# Altium project M2_Mosaic-G5_Smart.PrjPcb
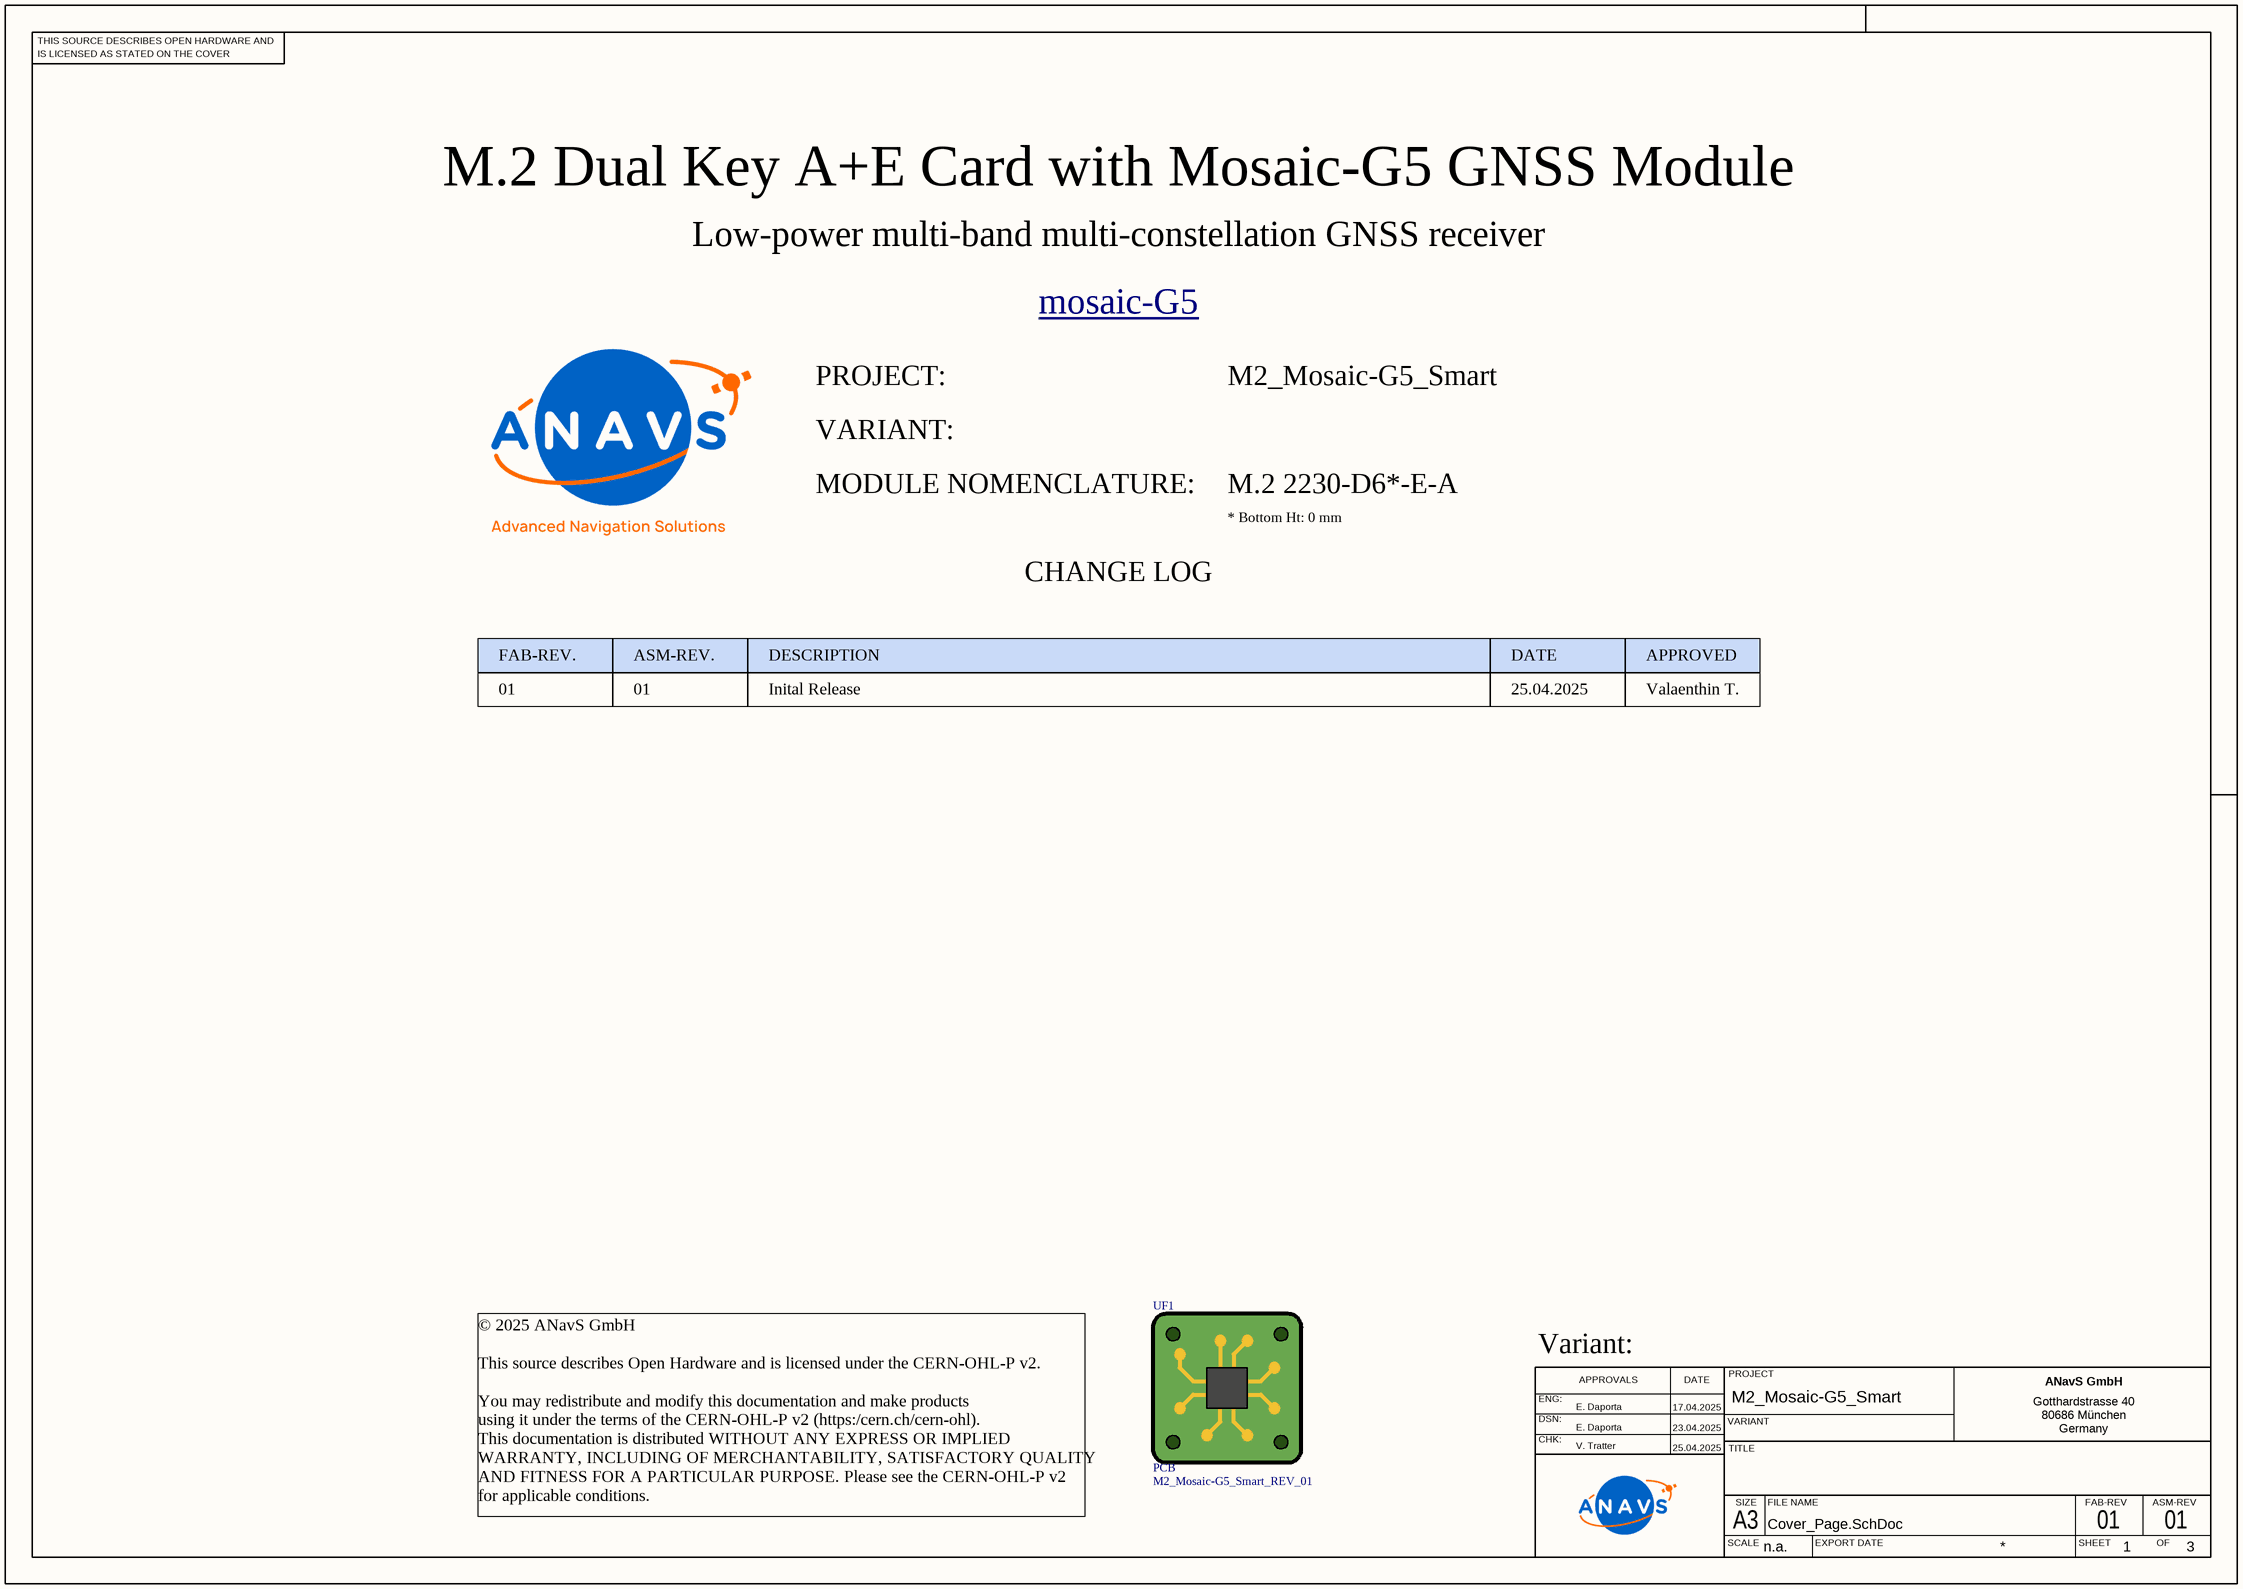
[diagram p0: Cover_Page.SchDoc]
ASM_REVISION: 01; Assembly_Drawing_Title: M2 Mosaic-G5 SMART PCBA Assembly; CheckedBy: V. Tratter; CHK_APP_DATE: 25.04.2025; COPYRIGHT: © ANavS 2025; DrawnBy: E. Daporta; DSN_APP_DATE: 23.04.2025; ENG_APP_DATE: 17.04.2025; Engineer: E. Daporta; FAB_REVISION: 01; Fabrication_Drawing_Title: M2 Mosaic-G5 SMART PCB Fabrication; LICENSE_NOTICE: Licensed under CERN-OHL-P v2; MODULE_NOMENCLATURE: M.2 2230-D6*-E-A; PROJECT: M2_Mosaic-G5_Smart; SCH_SCALE: n.a.
3 sheets, 17 parts. Net scope: flat (ports and power ports of the same name join across sheets).
Board file: M2_Mosaic-G5_Smart.PcbDoc
Sheets:
  Cover_Page.SchDoc
  M.2_Key_A+E_Card.SchDoc
  Mosaic-G5.SchDoc

## Sheet Cover_Page.SchDoc
size 420 x 297 mm; CompanyName: ANavS GmbH; Organization: ANavS; Address1: ANavS GmbH; Address2: Gotthardstrasse 40; Address3: 80686 München; Address4: Germany; SheetNumber: 1; SheetTotal: 3

### Parts
UF1  PCB  value M2_Mosaic-G5_Smart_REV_01  (mechanical)

### Notes on the sheet
- M.2 Dual Key A+E Card with Mosaic-G5 GNSS Module
- Low-power multi-band multi-constellation GNSS receiver
- mosaic-G5 <https://www.septentrio.com/en/septentrio-extends-its-mosaic-family>
- PROJECT:
- VARIANT:
- MODULE NOMENCLATURE:
- * Bottom Ht: 0 mm
- CHANGE LOG
- FAB-REV.
- ASM-REV.
- DESCRIPTION
- DATE
- APPROVED
- 01
- Inital Release
- 25.04.2025
- Valaenthin T.
- Variant:
- © 2025 ANavS GmbH
  This source describes Open Hardware and is licensed under the CERN-OHL-P v2.
  You may redistribute and modify this documentation and make products
  using it under the terms of the CERN-OHL-P v2 (https:/cern.ch/cern-ohl).
  This documentation is distributed WITHOUT ANY EXPRESS OR IMPLIED
  WARRANTY, INCLUDING OF MERCHANTABILITY, SATISFACTORY QUALITY
  AND FITNESS FOR A PARTICULAR PURPOSE. Please see the CERN-OHL-P v2
  for applicable conditions.
- THIS SOURCE DESCRIBES OPEN HARDWARE AND
- IS LICENSED AS STATED ON THE COVER
- ENG:
- APPROVALS
- PROJECT
- DSN:
- CHK:
- VARIANT
- TITLE
- SCALE
- A3
- SIZE
- FILE NAME
- EXPORT DATE
- SHEET
- FAB-REV
- ASM-REV
- OF

### Library data of the parts
UF1 = CMP-00001-7: Printed Circuit Board

## Sheet M.2_Key_A+E_Card.SchDoc
size 420 x 297 mm; CompanyName: ANavS GmbH; Organization: ANavS; Address1: ANavS GmbH; Address2: Gotthardstrasse 40; Address3: 80686 München; Address4: Germany; SheetNumber: 2; SheetTotal: 3
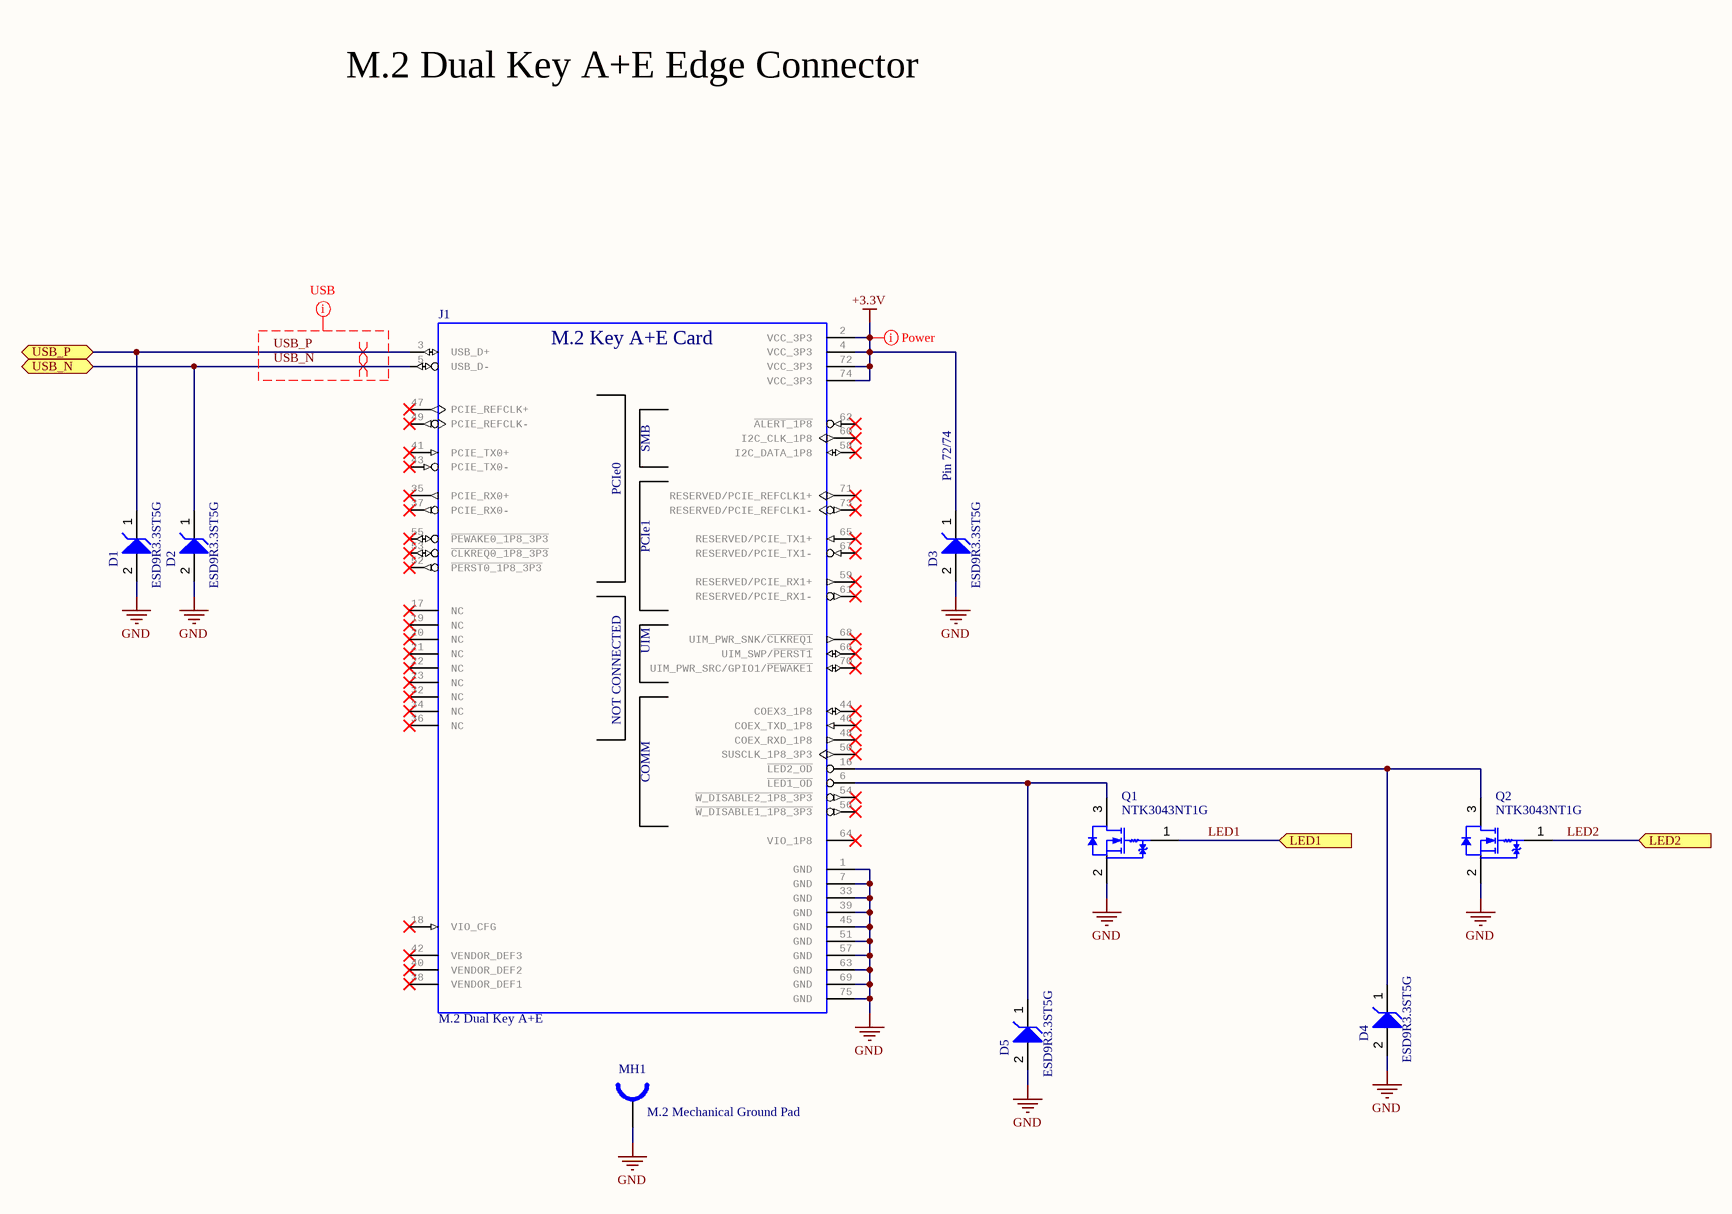
[diagram p1: M.2_Key_A+E_Card.SchDoc]

### Parts
D1  ESD9R3.3ST5G  [ONSC-SOD-923-2-514AB-01_V]
D2  ESD9R3.3ST5G  [ONSC-SOD-923-2-514AB-01_V]
D3  ESD9R3.3ST5G  [ONSC-SOD-923-2-514AB-01_V]
D4  ESD9R3.3ST5G  [ONSC-SOD-923-2-514AB-01_V]
D5  ESD9R3.3ST5G  [ONSC-SOD-923-2-514AB-01_V]
J1  M.2 Dual Key A+E  [M.2 Key A+E card-Footprint]  (no BOM)
MH1  M.2 Mechanical Ground Pad  [M.2 Mechanical Ground Pad Footprint]  (no BOM)
Q1  NTK3043NT1G  [ONSC-SOT-723-3-631AA-01_V]
Q2  NTK3043NT1G  [ONSC-SOT-723-3-631AA-01_V]

### Ports
LED1 (in), LED2 (in), USB_N (bidir), USB_P (bidir)

### Nets
+3.3V: D3.1(K) J1.2(VCC_3P3) J1.4(VCC_3P3) J1.72(VCC_3P3) J1.74(VCC_3P3)
GND: D1.2(A) D2.2(A) D3.2(A) D4.2(A) D5.2(A) J1.1(GND) J1.7(GND) J1.33(GND) J1.39(GND) J1.45(GND) J1.51(GND) J1.57(GND) J1.63(GND) J1.69(GND) J1.75(GND) MH1.0(Chassis) Q1.2(S) Q2.2(S)
LED1: Q1.1(G) ; port LED1
LED2: Q2.1(G) ; port LED2
USB_N: D2.1(K) J1.5(USB_D-) ; port USB_N
USB_P: D1.1(K) J1.3(USB_D+) ; port USB_P
NetD4_1: D4.1(K) J1.16(~{LED2_OD}) Q2.3(D)
NetD5_1: D5.1(K) J1.6(~{LED1_OD}) Q1.3(D)

Not connected (* = marked no-connect by the designer): J1 17(NC)* 18(VIO_CFG)* 19(NC)* 20(NC)* 21(NC)* 22(NC)* 23(NC)* 32(NC)* 34(NC)* 35(PCIE_RX0+)* 36(NC)* 37(PCIE_RX0-)* 38(VENDOR_DEF1)* 40(VENDOR_DEF2)* 41(PCIE_TX0+)* 42(VENDOR_DEF3)* 43(PCIE_TX0-)* 44(COEX3_1P8)* 46(COEX_TXD_1P8)* 47(PCIE_REFCLK+)* 48(COEX_RXD_1P8)* 49(PCIE_REFCLK-)* 50(SUSCLK_1P8_3P3)* 52(~{PERST0_1P8_3P3})* 53(~{CLKREQ0_1P8_3P3})* 54(~{W_DISABLE2_1P8_3P3})* 55(~{PEWAKE0_1P8_3P3})* 56(~{W_DISABLE1_1P8_3P3})* 58(I2C_DATA_1P8)* 59(RESERVED/PCIE_RX1+)* 60(I2C_CLK_1P8)* 61(RESERVED/PCIE_RX1-)* 62(~{ALERT_1P8})* 64(VIO_1P8)* 65(RESERVED/PCIE_TX1+)* 66(UIM_SWP/~{PERST1})* 67(RESERVED/PCIE_TX1-)* 68(UIM_PWR_SNK/~{CLKREQ1})* 70(UIM_PWR_SRC/GPIO1/~{PEWAKE1})* 71(RESERVED/PCIE_REFCLK1+)* 73(RESERVED/PCIE_REFCLK1-)*

### Layout directives
net class Power: +3.3V
differential pair: USB_N, USB_P
net class USB2.0: USB_N, USB_P

### Notes on the sheet
- M.2 Dual Key A+E Edge Connector
- Pin 72/74
- THIS SOURCE DESCRIBES OPEN HARDWARE AND
- IS LICENSED AS STATED ON THE COVER
- ENG:
- APPROVALS
- DATE
- PROJECT
- DSN:
- CHK:
- VARIANT
- TITLE
- SCALE
- A3
- SIZE
- FILE NAME
- EXPORT DATE
- SHEET
- FAB-REV
- ASM-REV
- OF
- (in symbol CMP-002-00134-7) M.2 Key A+E Card; SMB; PCIe0; PCIe1; UIM; NOT CONNECTED; COMM

### Library data of the parts
D1-D5 = CMP-004-00061-1: ESD9R3.3S Series 4.8 V 0.5 pF Uni-Directional ESD Protection Diode - SOD-923; Breakdown Voltage: 4.8V; Clamping Voltage-Max: 7.8V; Number of Unidirectional Channels: 1; Polarity: Unidirectional; Operating Supply Voltage: 3.3V; Value: 0.9pF; Peak Pulse Current: 1A; ESD Protection: Yes; Max Reverse Leakage Current: 1nA; Max Power Dissipation: 150mW; Power Line Protection: No; Test Current: 1mA; Diode Type: ZENER; Pins: 2; Reach SVHC Compliant: No; Min Operating Temperature: -55°C; Depth: 0.6mm; Height: 0.4mm; Lead Free: Lead Free; Radiation Hardening: No; Number of Elements: 1; Case/Package: SOD-923-2; Number of Channels: 1; Min Breakdown Voltage: 4.8V; Halogen Free: Halogen Free; Width: 0.65mm; Reverse Standoff Voltage: 3.3V; Packaging: Tape and Reel; Package Quantity: 8000; Working Voltage: 3.3V; Max Breakdown Voltage: 4.8V; Length: 0.8mm; Direction: Unidirectional; Max Surge Current: 1A; Termination: SMD/SMT; Max Operating Temperature: 125°C; Leakage Current: 1nA; Peak Pulse Power: 150mW; Clamping Voltage: 7.8V; Series: -; Number of Lines: 1
J1 = CMP-002-00134-7: Golden finger, M.2 Key A+E, Dual, Staggered, Pitch 0.5mm; PCI Express M.2 Specification: Revision 4.0, Version 1.0; ClassName: Edge Connector
MH1 = CMP-00028-00011-5
Q1 Q2 = CMP-013-00043-1: Single N-Channel Small Signal MOSFET with ESD Protection 20V, 285mA, 3.4Ω; Fall Time: 15ns; Max Power Dissipation: 310mW; Drain-source On Resistance-Max: 3.4R; Continuous Drain Current (ID): 210mA; Power Dissipation: 440mW; Turn-Off Delay Time: 94ns; Turn-On Delay Time: 13ns; Threshold Voltage: 400mV; Number of Elements: 1; Input Capacitance: 11pF; Current Rating: 225mA; Gate to Source Voltage (Vgs): 10V; Voltage Rating (DC): 20V; Package Quantity: 4000; Case/Package: SOT-723-3; Rise Time: 15ns; RoHS Compliant: Yes; Height: 0.55mm; Reach SVHC Compliant: No; Drain to Source Breakdown Voltage: 20V; Width: 0.85mm; Packaging: Tape and Reel; Drain to Source Resistance: 3.4R; Pins: 3; Length: 1.25mm; Series: -; Element Configuration: Single; Drain to Source Voltage (Vdss): 20V; Lead Free: Lead Free; Polarity: N-CHANNEL; Radiation Hardening: No; Max Operating Temperature: 150°C; Rds On Max: 3.4R; Min Operating Temperature: -55°C

## Sheet Mosaic-G5.SchDoc
size 420 x 297 mm; CompanyName: ANavS GmbH; Organization: ANavS; Address1: ANavS GmbH; Address2: Gotthardstrasse 40; Address3: 80686 München; Address4: Germany; SheetNumber: 3; SheetTotal: 3
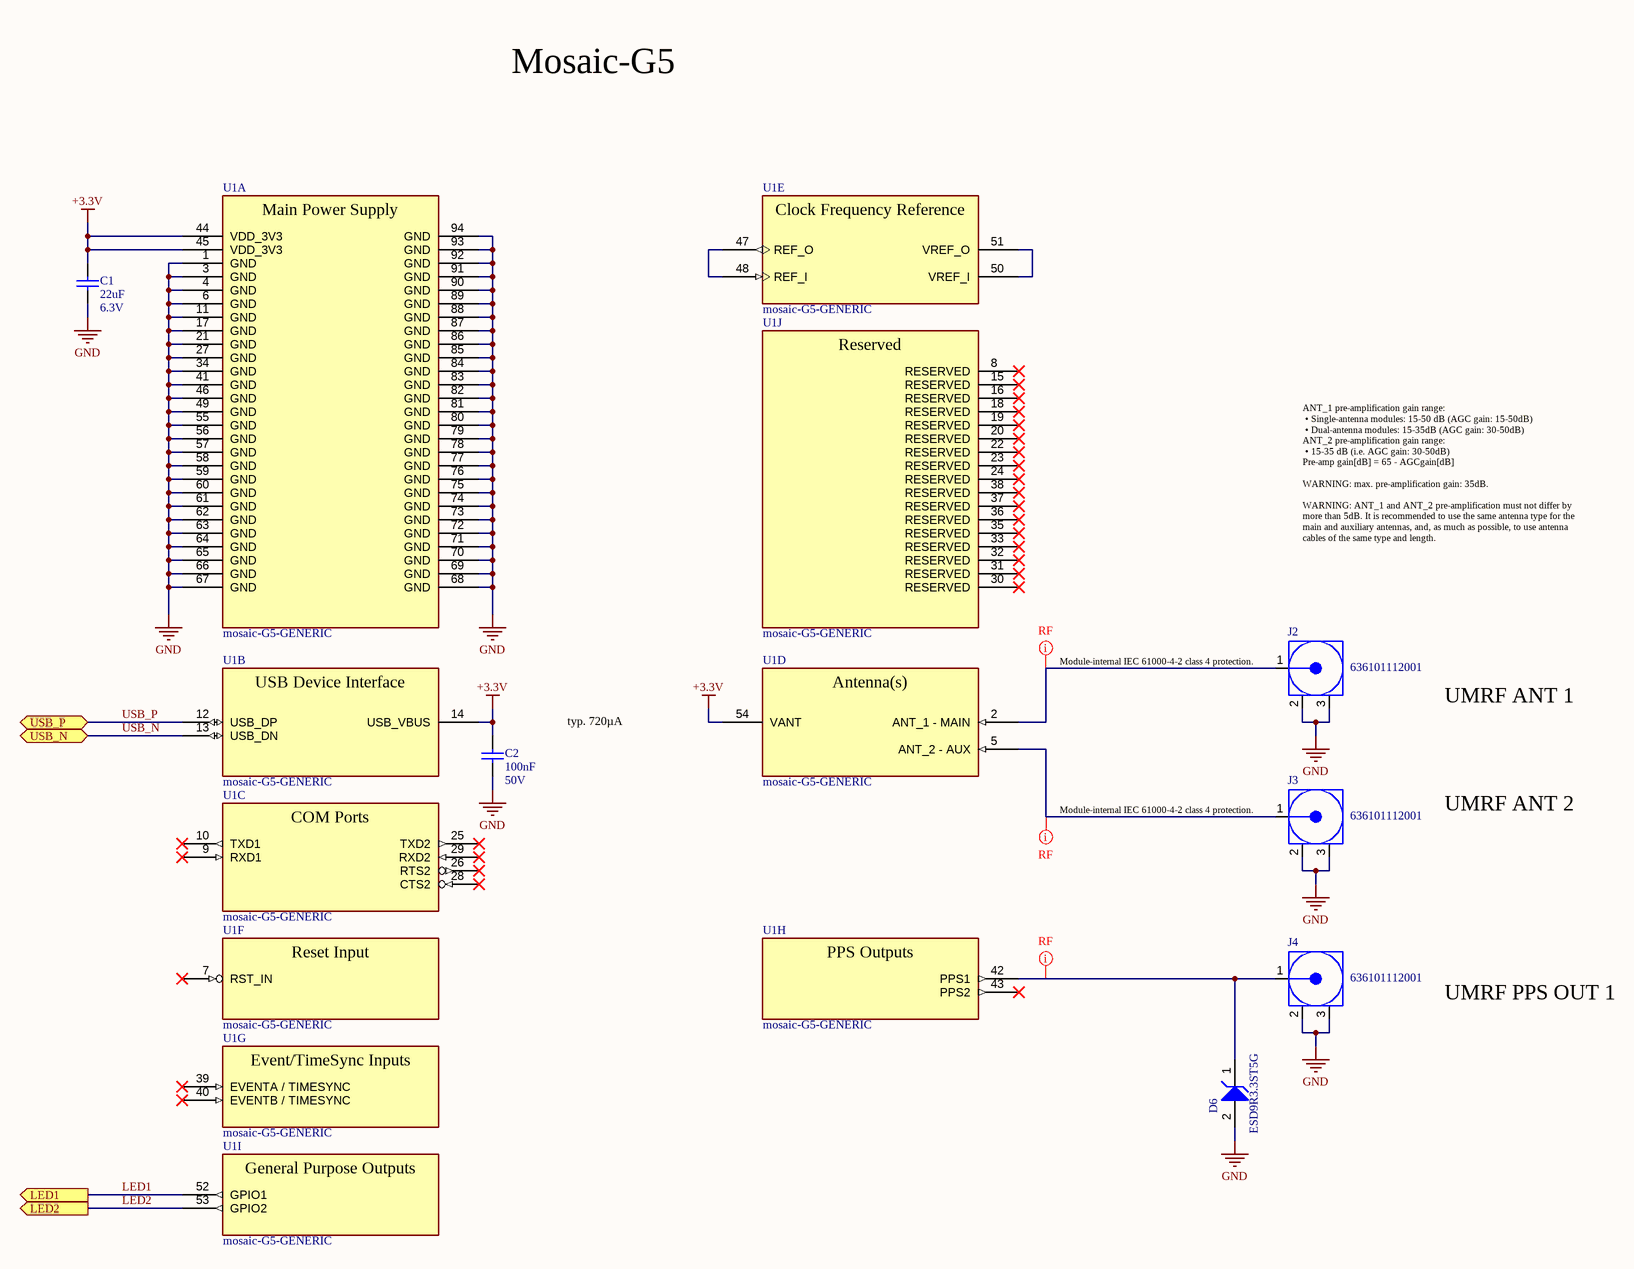
[diagram p2: Mosaic-G5.SchDoc]

### Parts
C1  value 22uF  Voltage: 6.3V  [CAPC1608X100X20ML10]  (hidden comment: C1608X5R0J226M080AC)
C2  Capacitance: 100nF  Voltage: 50V  [CAP0402C]  (hidden comment: GCM155R71H104KE02D)
D6  ESD9R3.3ST5G  [ONSC-SOD-923-2-514AB-01_V]
J2  636101112001  [63610111x001]
J3  636101112001  [63610111x001]
J4  636101112001  [63610111x001]
U1  mosaic-G5-GENERIC  [mosaic-G5-GENERIC-Footprint]  (parts A,B,C,D,E,F,G,H,I,J of 10)

### Ports
LED1 (out), LED2 (out), USB_N (bidir), USB_P (bidir)

### Nets
+3.3V: C1.2 C2.2 U1.14(USB_VBUS) U1.44(VDD_3V3) U1.45(VDD_3V3) U1.54(VANT)
GND: C1.1 C2.1 D6.2(A) J2.2(GND) J2.3(GND) J3.2(GND) J3.3(GND) J4.2(GND) J4.3(GND) U1.1(GND) U1.3(GND) U1.4(GND) U1.6(GND) U1.11(GND) U1.17(GND) U1.21(GND) U1.27(GND) U1.34(GND) U1.41(GND) U1.46(GND) U1.49(GND) U1.55(GND) U1.56(GND) U1.57(GND) U1.58(GND) U1.59(GND) U1.60(GND) U1.61(GND) U1.62(GND) U1.63(GND) U1.64(GND) U1.65(GND) U1.66(GND) U1.67(GND) U1.68(GND) U1.69(GND) U1.70(GND) U1.71(GND) U1.72(GND) U1.73(GND) U1.74(GND) U1.75(GND) U1.76(GND) U1.77(GND) U1.78(GND) U1.79(GND) U1.80(GND) U1.81(GND) U1.82(GND) U1.83(GND) U1.84(GND) U1.85(GND) U1.86(GND) U1.87(GND) U1.88(GND) U1.89(GND) U1.90(GND) U1.91(GND) U1.92(GND) U1.93(GND) U1.94(GND)
LED1: U1.52(GPIO1) ; port LED1
LED2: U1.53(GPIO2) ; port LED2
USB_N: U1.13(USB_DN) ; port USB_N
USB_P: U1.12(USB_DP) ; port USB_P
NetD6_1: D6.1(K) J4.1(Signal) U1.42(PPS1)
NetJ2_1: J2.1(Signal) U1.2(ANT_1_-_MAIN)
NetJ3_1: J3.1(Signal) U1.5(ANT_2_-_AUX)
NetU1_47: U1.47(REF_O) U1.48(REF_I)
NetU1_50: U1.50(VREF_I) U1.51(VREF_O)

Not connected (* = marked no-connect by the designer): U1 7(RST_IN)* 8(RESERVED)* 9(RXD1)* 10(TXD1)* 15(RESERVED)* 16(RESERVED)* 18(RESERVED)* 19(RESERVED)* 20(RESERVED)* 22(RESERVED)* 23(RESERVED)* 24(RESERVED)* 25(TXD2)* 26(RTS2)* 28(CTS2)* 29(RXD2)* 30(RESERVED)* 31(RESERVED)* 32(RESERVED)* 33(RESERVED)* 35(RESERVED)* 36(RESERVED)* 37(RESERVED)* 38(RESERVED)* 39(EVENTA_/_TIMESYNC)* 40(EVENTB_/_TIMESYNC)* 43(PPS2)*

### Layout directives
net class RF: NetD6_1, NetJ2_1, NetJ3_1

### Notes on the sheet
- Mosaic-G5
- ANT_1 pre-amplification gain range:
  • Single-antenna modules: 15-50 dB (AGC gain: 15-50dB)
  • Dual-antenna modules: 15-35dB (AGC gain: 30-50dB)
  ANT_2 pre-amplification gain range:
  • 15-35 dB (i.e. AGC gain: 30-50dB)
  Pre-amp gain[dB] = 65 - AGCgain[dB]
  WARNING: max. pre-amplification gain: 35dB.
  WARNING: ANT_1 and ANT_2 pre-amplification must not differ by more than 5dB. It is recommended to use the same antenna type for the main and auxiliary antennas, and, as much as possible, to use antenna cables of the same type and length.
- (near J2) Module-internal IEC 61000-4-2 class 4 protection.
- UMRF ANT 1
- (near C2) typ. 720µA
- (near J3) Module-internal IEC 61000-4-2 class 4 protection.
- UMRF ANT 2
- UMRF PPS OUT 1
- THIS SOURCE DESCRIBES OPEN HARDWARE AND
- IS LICENSED AS STATED ON THE COVER
- ENG:
- APPROVALS
- DATE
- PROJECT
- DSN:
- CHK:
- VARIANT
- TITLE
- SCALE
- A3
- SIZE
- FILE NAME
- EXPORT DATE
- SHEET
- FAB-REV
- ASM-REV
- OF
- (in symbol CMP-00025-00009-1, part A) Main Power Supply
- (in symbol CMP-00025-00009-1, part B) USB Device Interface
- (in symbol CMP-00025-00009-1, part C) COM Ports
- (in symbol CMP-00025-00009-1, part D) Antenna(s)
- (in symbol CMP-00025-00009-1, part E) Clock Frequency Reference
- (in symbol CMP-00025-00009-1, part F) Reset Input
- (in symbol CMP-00025-00009-1, part G) Event/TimeSync Inputs
- (in symbol CMP-00025-00009-1, part H) PPS Outputs
- (in symbol CMP-00025-00009-1, part I) General Purpose Outputs
- (in symbol CMP-00025-00009-1, part J) Reserved

### Library data of the parts
C1 = CMP-001-00146-1: MLCC, 22 uF, 0603, 6.3 V, 20%, X5R; Dielectric Material: Ceramic; Case Code (Metric): 1608; Max Operating Temperature: 85°C; RoHS Compliant: Yes; Mounting Technology: Surface Mount; Width: 0.031inch; Lead Free: Lead Free; Length: 1.6mm; Height: 0.8mm; Case Code (Imperial): 0603; Series: C; Depth: 0.8mm; Weight: 7.1E-05oz; Package Quantity: 1; Voltage Rating: 6.3V; Termination: SMD/SMT; Packaging: Tape and Reel; Voltage Rating (DC): 6.3V; Case/Package: 0603; Thickness: 0.039inch; Reach SVHC Compliant: Unknown; Dielectric: X5R; Min Operating Temperature: -55°C; Tolerance: 20%
C2 = CMP-001-00114-5: MLCC, 100 nF, 0402, 50 V, 10%, X7R; Weight: 0.000212oz; Case/Package: 0402; RoHS Compliant: Yes; Ratings: AEC-Q200; Max Operating Temperature: 125°C; Voltage Rating: 50V; Case Code (Metric): 1005; Width: 0.02inch; Length: 0.039inch; Height: 0.5mm; Series: GCM; Reach SVHC Compliant: Yes; Case Code (Imperial): 0402; Dielectric: X7R; Packaging: Tape and Reel; Thickness: 0.022inch; Min Operating Temperature: -55°C; Lead Free: Lead Free; Package Quantity: 10000; Tolerance: 10%; Mount: Surface Mount; Voltage Rating (DC): 50V; Termination: SMD/SMT
D6 = CMP-004-00061-1: as D1 on sheet M.2_Key_A+E_Card; Pins: 2; Reach SVHC Compliant: No; Min Operating Temperature: -55°C; Depth: 0.6mm; Height: 0.4mm; Lead Free: Lead Free; Radiation Hardening: No; Number of Elements: 1; Case/Package: SOD-923-2; Number of Channels: 1; Min Breakdown Voltage: 4.8V; Halogen Free: Halogen Free; Width: 0.65mm; Reverse Standoff Voltage: 3.3V; Packaging: Tape and Reel; Package Quantity: 8000; Working Voltage: 3.3V; Max Breakdown Voltage: 4.8V; Length: 0.8mm; Direction: Unidirectional; Max Surge Current: 1A; Termination: SMD/SMT; Max Operating Temperature: 125°C; Leakage Current: 1nA; Peak Pulse Power: 150mW; Clamping Voltage: 7.8V; Series: -; Number of Lines: 1
J2-J4 = CMP-002-00136-3: Rf Conn, Umrf, Jack, 50 Ohm, Pcb Rohs Compliant: Yes; Impedance: 50R; Insulation Resistance: 500MR; Max Operating Temperature: 90°C; Packaging: Tape and Reel; Min Operating Temperature: -40°C
U1 = CMP-00025-00009-1: mosaic-G5 GNSS Module - Low-power multi-band multi-constellation GNSS receiver.; Manufacturer: septentrio; Max RF input power at ANT_1: 20dBm; Max Power Consumption: 785mW; Peak Current Consumption: 500mA; Max RF input power at ANT_2: 10dBm; Feature 1: dual antenna; Feature 2: 10 MHz in; Min Storage Temperature: -55°C; Weight: 2.2g; Max Operating Temperature: +85°C; Min Operating Temperature: -40°C; Max Storage Temperature: +85°C

## Nets that join several sheets
+3.3V: M.2_Key_A+E_Card (5 pins), Mosaic-G5 (6 pins)
GND: M.2_Key_A+E_Card (18 pins), Mosaic-G5 (61 pins)
LED1: M.2_Key_A+E_Card (Q1.1), Mosaic-G5 (U1.52)
LED2: M.2_Key_A+E_Card (Q2.1), Mosaic-G5 (U1.53)
USB_N: M.2_Key_A+E_Card (D2.1 J1.5), Mosaic-G5 (U1.13)
USB_P: M.2_Key_A+E_Card (D1.1 J1.3), Mosaic-G5 (U1.12)

## Assembly variants
Mosaic-G5_P1: not fitted J3; alternate parts U1 -> CMP-001-0014-3
Mosaic-G5_P3: not fitted J3; alternate parts U1 -> CMP-00025-00006-2
Mosaic-G5_P3H: alternate parts U1 -> CMP-00025-00007-2
Mosaic-G5_P6H: alternate parts U1 -> CMP-00025-00008-2